# Altium schematic sheet V1_1001_REV2.SchDoc
size C
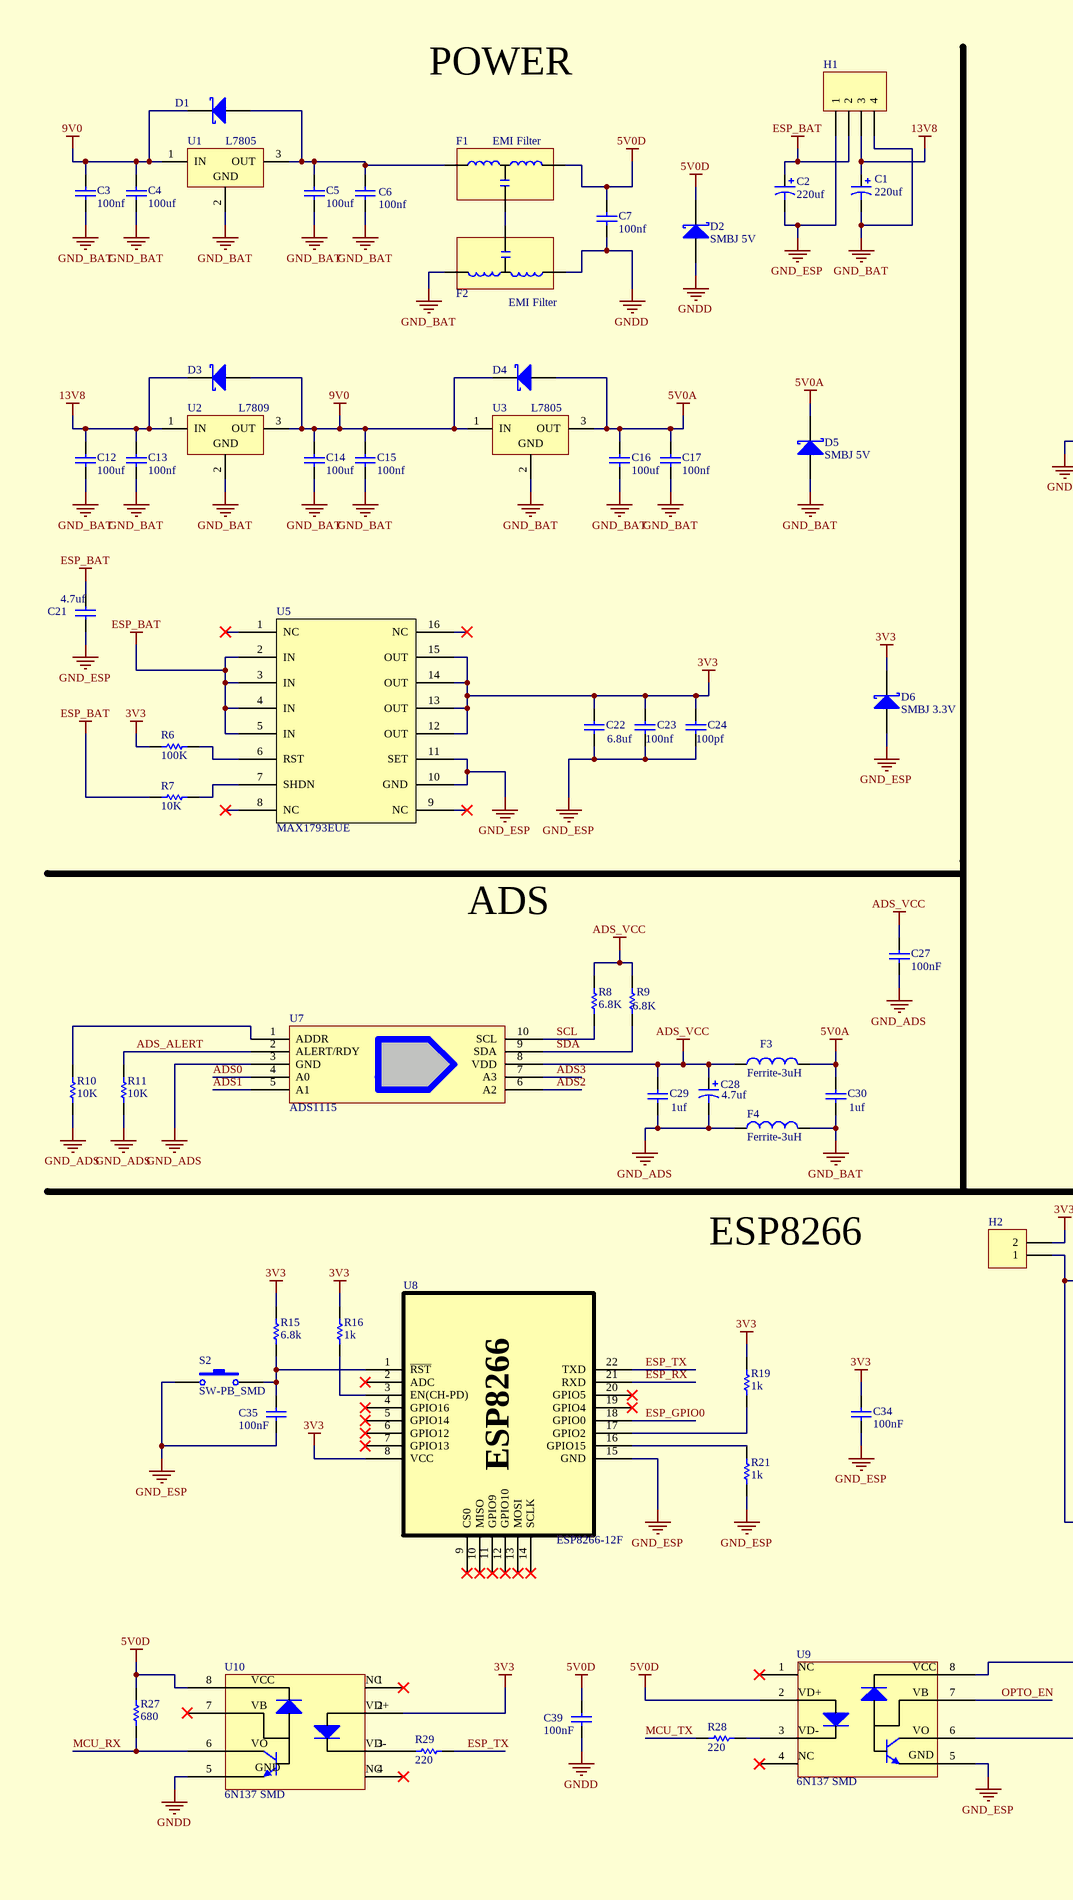
[diagram p0: V1_1001_REV2.SchDoc, left]
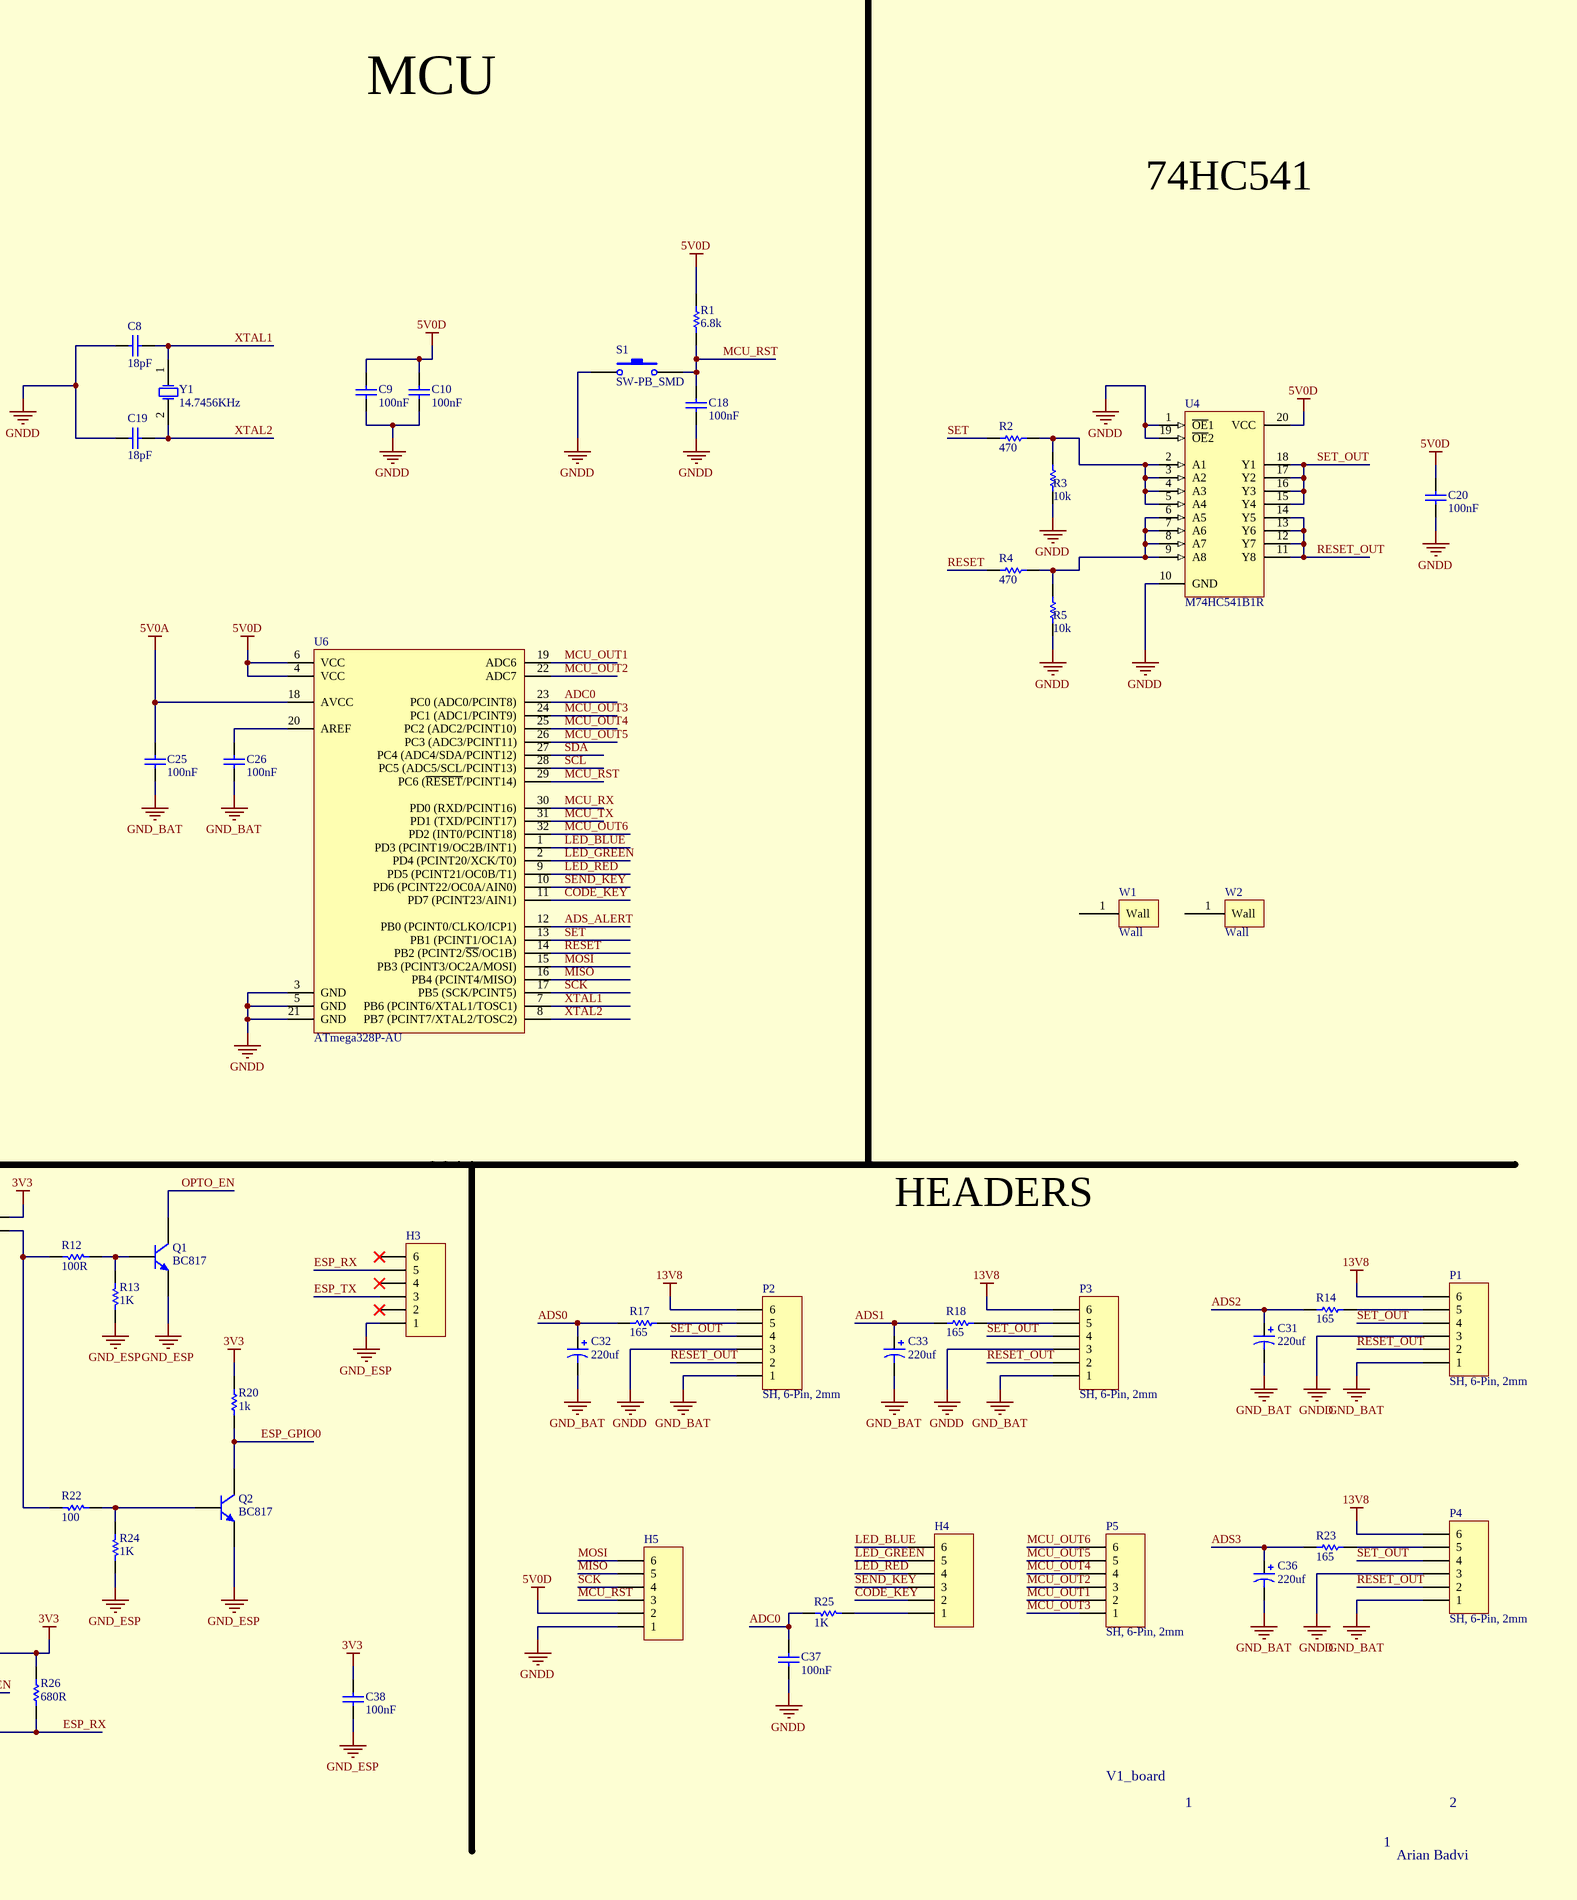
[diagram p1: V1_1001_REV2.SchDoc, right]

## Parts
C1  220uf  [C_CYL_SMD2]
C2  220uf  [C_CYL_SMD2]
C3  100nf  [1206]
C4  100uf  [1206]
C5  100uf  [1206]
C6  100nf  [1206]
C7  100nf  [1206]
C8  18pF  [1206]
C9  100nF  [1206]
C10  100nF  [1206]
C12  100uf  [1206]
C13  100nf  [1206]
C14  100uf  [1206]
C15  100nf  [1206]
C16  100uf  [1206]
C17  100nf  [1206]
C18  100nF  [1206]
C19  18pF  [1206]
C20  100nF  [1206]
C21  4.7uf  [1206]
C22  6.8uf  [1206]
C23  100nf  [1206]
C24  100pf  [1206]
C25  100nF  [1206]
C26  100nF  [1206]
C27  100nF  [1206]
C28  4.7uf  [CAP_SMD_A]
C29  1uf  [1206]
C30  1uf  [1206]
C31  220uf  [CAP_SMD_D]
C32  220uf  [CAP_SMD_D]
C33  220uf  [CAP_SMD_D]
C34  100nF  [1206]
C35  100nF  [1206]
C36  220uf  [CAP_SMD_D]
C37  100nF  [1206]
C38  100nF  [1206]
C39  100nF  [1206]
D1  D Schottky  [ZINER]  (value not drawn)
D2  SMBJ 5V  [TVS]
D3  D Schottky  [ZINER]  (value not drawn)
D4  D Schottky  [ZINER]  (value not drawn)
D5  SMBJ 5V  [TVS]
D6  SMBJ 3.3V  [TVS]
F1  EMI Filter  [HDR1X3]
F2  EMI Filter  [HDR1X3]
F3  Ferrite-3uH  [1206]
F4  Ferrite-3uH  [1206]
H1  White Connector 4pin  [XH_4_me]  (value not drawn)
H2  Pin Header, 1.27  [H1.27]  (value not drawn)
H3  White SMD Connector 6pin  [White SMD Connector 6pin B]  (value not drawn)
H4  White SMD Connector 6pin  [White SMD Connector 6pin B]  (value not drawn)
H5  White SMD Connector 6pin  [White SMD Connector 6pin B]  (value not drawn)
P1  SH, 6-Pin, 2mm  [PH_6_ME]
P2  SH, 6-Pin, 2mm  [PH_6_ME]
P3  SH, 6-Pin, 2mm  [PH_6_ME]
P4  SH, 6-Pin, 2mm  [PH_6_ME]
P5  SH, 6-Pin, 2mm  [PH_6_ME]
Q1  BC817  [sot23]
Q2  BC817  [sot23]
R1  6.8k  [1206]
R2  470  [1206]
R3  10k  [1206]
R4  470  [1206]
R5  10k  [1206]
R6  100K  [1206]
R7  10K  [1206]
R8  6.8K  [1206]
R9  6.8K  [1206]
R10  10K  [1206]
R11  10K  [1206]
R12  100R  [1206]
R13  1K  [1206]
R14  165  [1206]
R15  6.8k  [1206]
R16  1k  [1206]
R17  165  [1206]
R18  165  [1206]
R19  1k  [1206]
R20  1k  [1206]
R21  1k  [1206]
R22  100  [1206]
R23  165  [1206]
R24  1K  [1206]
R25  1K  [1206]
R26  680R  [1206]
R27  680  [1206]
R28  220  [1206]
R29  220  [1206]
S1  SW-PB_SMD  [PB4x3.2]
S2  SW-PB_SMD  [PB4x3.2]
U1  L7805  [DPAK]
U2  L7809  [DPAK]
U3  L7805  [DPAK]
U4  M74HC541B1R  [TSSOP20]
U5  MAX1793EUE  [TSSOP16]
U6  ATmega328P-AU  [32A_L]
U7  ADS1115  [TSSOP10_N]
U8  ESP8266-12F  [esp8266 esp-12-e]
U9  6N137 SMD  [SMD8]
U10  6N137 SMD  [SMD8]
W1  Wall  [Wall]
W2  Wall  [Wall]
Y1  14.7456KHz  [XTAL_SMD]

## Nets
3V3: C22.2 C23.2 C24.2 C34.2 C38.2 D6.1(K) H2.2 R6.2 R15.1 R16.2 R19.2 R20.1 R26.2 U5.12(OUT) U5.13(OUT) U5.14(OUT) U5.15(OUT) U8.8(VCC) U9.8 U10.2
5V0A: C16.2 C17.2 C25.2 C30.2 D4.1(A) D5.1(K) F3.2 U3.3(OUT) U6.18(AVCC)
5V0D: C7.2 C9.2 C10.2 C20.1 C39.2 D2.1(K) F1.3 H5.2 R1.1 R27.1 U4.20(VCC) U6.4(VCC) U6.6(VCC) U9.2 U10.8
9V0: C3.2 C4.2 C14.2 C15.2 D1.2(K) D3.1(A) D4.2(K) U1.1(IN) U2.3(OUT) U3.1(IN)
13V8: C1.1 C12.2 C13.2 D3.2(K) H1.3 P1.6 P2.6 P3.6 P4.6 U2.1(IN)
ADS_VCC: C27.2 C28.1 C29.2 F3.1 R8.1 R9.1 U7.8(VDD)
ESP_BAT: C2.1 C21.2 H1.2 R7.2 U5.2(IN) U5.3(IN) U5.4(IN) U5.5(IN)
GND_ADS: C27.1 C28.2 C29.1 F4.1 R10.1 R11.1 U7.3(GND)
GND_BAT: C1.2 C3.1 C4.1 C5.1 C6.1 C12.1 C13.1 C14.1 C15.1 C16.1 C17.1 C25.1 C26.1 C30.1 C31.2 C32.2 C33.2 C36.2 D5.2(A) F2.3 F4.2 H1.4 P1.1 P2.1 P3.1 P4.1 U1.2(GND) U2.2(GND) U3.2(GND)
GND_ESP: C2.2 C21.1 C22.1 C23.1 C24.1 C34.1 C35.1 C38.1 D6.2(A) H1.1 H3.1 Q1.1(E) Q2.1(E) R13.1 R21.2 R24.1 S2.1 U5.10(GND) U5.11(SET) U8.15(GND) U9.5(GND)
GNDD: C7.1 C8.1 C9.1 C10.1 C18.1 C19.1 C20.2 C37.1 C39.1 D2.2(A) F2.1 H5.1 P1.3 P2.3 P3.3 P4.3 R3.1 R5.1 S1.1 U4.1(~{OE}1) U4.10(GND) U4.19(~{OE}2) U6.3(GND) U6.5(GND) U6.21(GND) U10.5(GND)
ADC0: C37.2 R25.1 U6.23(PC0_(ADC0/PCINT8))
ADS0: C32.1 R17.2 U7.4(A0)
ADS1: C33.1 R18.2 U7.5(A1)
ADS2: C31.1 R14.2 U7.6(A2)
ADS3: C36.1 R23.2 U7.7(A3)
ADS_ALERT: R11.2 U6.12(PB0_(PCINT0/CLKO/ICP1)) U7.2(ALERT/RDY)
CODE_KEY: H4.2 U6.11(PD7_(PCINT23/AIN1))
ESP_GPIO0: Q2.3(C) R20.2 U8.18(GPIO0)
ESP_RX: H3.5 R26.1 U8.21(RXD) U9.6
ESP_TX: H3.3 R29.2 U8.22(TXD)
LED_BLUE: H4.6 U6.1(PD3_(PCINT19/OC2B/INT1))
LED_GREEN: H4.5 U6.2(PD4_(PCINT20/XCK/T0))
LED_RED: H4.4 U6.9(PD5_(PCINT21/OC0B/T1))
MCU_OUT1: P5.2 U6.19(ADC6)
MCU_OUT2: P5.3 U6.22(ADC7)
MCU_OUT3: P5.1 U6.24(PC1_(ADC1/PCINT9))
MCU_OUT4: P5.4 U6.25(PC2_(ADC2/PCINT10))
MCU_OUT5: P5.5 U6.26(PC3_(ADC3/PCINT11))
MCU_OUT6: P5.6 U6.32(PD2_(INT0/PCINT18))
MCU_RST: C18.2 H5.3 R1.2 S1.2 U6.29(PC6_(~{RESET}/PCINT14))
MCU_RX: R27.2 U6.30(PD0_(RXD/PCINT16)) U10.6
MCU_TX: R28.1 U6.31(PD1_(TXD/PCINT17))
MISO: H5.5 U6.16(PB4_(PCINT4/MISO))
MOSI: H5.6 U6.15(PB3_(PCINT3/OC2A/MOSI))
OPTO_EN: Q1.3(C) U9.7
RESET: R4.2 U6.14(PB2_(PCINT2/~{SS}/OC1B))
RESET_OUT: P1.2 P2.2 P3.2 P4.2 U4.11(Y8) U4.12(Y7) U4.13(Y6) U4.14(Y5)
SCK: H5.4 U6.17(PB5_(SCK/PCINT5))
SCL: R8.2 U6.28(PC5_(ADC5/SCL/PCINT13)) U7.10(SCL)
SDA: R9.2 U6.27(PC4_(ADC4/SDA/PCINT12)) U7.9(SDA)
SEND_KEY: H4.3 U6.10(PD6_(PCINT22/OC0A/AIN0))
SET: R2.2 U6.13(PB1_(PCINT1/OC1A))
SET_OUT: P1.4 P2.4 P3.4 P4.4 U4.15(Y4) U4.16(Y3) U4.17(Y2) U4.18(Y1)
XTAL1: C8.2 U6.7(PB6_(PCINT6/XTAL1/TOSC1)) Y1.1(OSC1)
XTAL2: C19.2 U6.8(PB7_(PCINT7/XTAL2/TOSC2)) Y1.2(OSC2)
NetC5_2: C5.2 C6.2 D1.1(A) F1.1 U1.3(OUT)
NetC26_2: C26.2 U6.20(AREF)
NetC35_2: C35.2 R15.2 S2.2 U8.1(~{RST})
NetF1_2: F1.2 F2.2
NetH2_1: H2.1 R12.1 R22.1
NetH4_1: H4.1 R25.2
NetP1_5: P1.5 R14.1
NetP2_5: P2.5 R17.1
NetP3_5: P3.5 R18.1
NetP4_5: P4.5 R23.1
NetQ1_2: Q1.2(B) R12.2 R13.2
NetQ2_2: Q2.2(B) R22.2 R24.2
NetR2_1: R2.1 R3.2 U4.2(A1) U4.3(A2) U4.4(A3) U4.5(A4)
NetR4_1: R4.1 R5.2 U4.6(A5) U4.7(A6) U4.8(A7) U4.9(A8)
NetR6_1: R6.1 U5.6(RST)
NetR7_1: R7.1 U5.7(SHDN)
NetR10_2: R10.2 U7.1(ADDR)
NetR16_1: R16.1 U8.3(EN(CH-PD))
NetR19_1: R19.1 U8.17(GPIO2)
NetR21_1: R21.1 U8.16(GPIO15)
NetR28_2: R28.2 U9.3
NetR29_1: R29.1 U10.3

Not connected (* = marked no-connect by the designer): H3 2* 4* 6*; U5 1(NC)* 8(NC)* 9(NC)* 16(NC)*; U8 2(ADC)* 4(GPIO16)* 5(GPIO14)* 6(GPIO12)* 7(GPIO13)* 9(CS0)* 10(MISO)* 11(GPIO9)* 12(GPIO10)* 13(MOSI)* 14(SCLK)* 19(GPIO4)* 20(GPIO5)*; U9 1* 4*; U10 1* 4* 7*; W1 1(Wall); W2 1(Wall)

## Notes on the sheet
- POWER
- MCU
- 74HC541
- ADS
- ESP8266
- HEADERS
- V1_board
- 1
- Arian Badvi
- 2
- (in symbol 6N137) VCC; NC; VB; VD+; VO; VD-

## Library data of the parts
C1 C2 = Cap Pol: pol cap, Ele; Published: 8-Jun-2000; LatestRevisionDate: 17-Jul-2002; LatestRevisionNote: Re-released for DXP Platform.; PackageReference: POLAR0.8; Publisher: Altium Limited; PackageDescription: Polarized Capacitor; 2 Leads; Value: 220uf
C3-C7 C12-C17 C21-C24 C29 C30 C39 = Cap: Capacitor, 1206; Published: 8-Jun-2000; LatestRevisionDate: 17-Jul-2002; LatestRevisionNote: Re-released for DXP Platform.; PackageReference: RAD-0.3; Publisher: Altium Limited
  C3 C6 C7 C13 C15 C17: Value: 100nf
  C4 C5 C12 C14 C16: Value: 100uf
  C21: PackageDescription: Radial Cap, Thru-Hole; 2 Leads; 0.3 in Pin Spacing; Value: 4.7uf
  C22: PackageDescription: Radial Cap, Thru-Hole; 2 Leads; 0.3 in Pin Spacing; Value: 6.8uf
  C23: PackageDescription: Radial Cap, Thru-Hole; 2 Leads; 0.3 in Pin Spacing; Value: 100nf
  C24: PackageDescription: Radial Cap, Thru-Hole; 2 Leads; 0.3 in Pin Spacing; Value: 100pf
  C29 C30: PackageDescription: Radial Cap, Thru-Hole; 2 Leads; 0.3 in Pin Spacing; Value: 1uf
  C39: Value: 100nF
C8-C10 C18 C19 C25-C27 C34 C35 C37 C38 = Cap: Capacitor; Published: 8-Jun-2000; LatestRevisionDate: 17-Jul-2002; LatestRevisionNote: Re-released for DXP Platform.; PackageReference: RAD-0.3; Publisher: Altium Limited
  C8 C19: Value: 18pF
  C9 C10 C18 C25-C27 C34 C35 C37 C38: Value: 100nF
C20 = Cap: Capacitor, 1206, 100nf; Published: 8-Jun-2000; LatestRevisionDate: 17-Jul-2002; LatestRevisionNote: Re-released for DXP Platform.; PackageReference: RAD-0.3; Publisher: Altium Limited; Value: 100nF
C28 = Cap Pol: Tantalium Capacitor; Published: 8-Jun-2000; LatestRevisionDate: 17-Jul-2002; LatestRevisionNote: Re-released for DXP Platform.; PackageReference: POLAR0.8; Publisher: Altium Limited; PackageDescription: Polarized Capacitor; 2 Leads; Value: 4.7uf
C31-C33 C36 = Cap Pol: pol cap, tan; Published: 8-Jun-2000; LatestRevisionDate: 17-Jul-2002; LatestRevisionNote: Re-released for DXP Platform.; PackageReference: POLAR0.8; Publisher: Altium Limited; PackageDescription: Polarized Capacitor; 2 Leads; Value: 220uf
D1 D3 D4 = D Schottky: Schottky Diode, 1N4148; Published: 8-Jun-2000; LatestRevisionDate: 17-Jul-2002; LatestRevisionNote: Re-released for DXP Platform.; PackageReference: SMB; Publisher: Altium Limited; Code_JEDEC: DO-214-AA
D2 D5 D6 = Diode 18TQ045: Schottky Rectifier; Note: Terminal 2 is the TAB and is electrically connected to the cathode; Published: 8-Jun-2000; LatestRevisionDate: 17-Jul-2002; LatestRevisionNote: Re-released for DXP Platform.; DatasheetVersion: Dec-1997; PackageVersion: Feb-1998; PackageReference: TO-220AC; Publisher: Altium Limited; ComponentLink1Description: Manufacturer Link; ComponentLink1URL: http://www.irf.com/; ComponentLink2Description: Datasheet; ComponentLink2URL: http://www.irf.com/product-info/datasheets/data/18tq.pdf
F3 F4 = Inductor: Code_IEC: 1005; Published: 8-Jun-2000; LatestRevisionDate: 29-May-2009; LatestRevisionNote: IPC-7351 Footprint Added.; PackageReference: 0402-A; Publisher: Altium Limited; PackageDescription: Chip Inductor; Code_JEITA: 0402
H1 = Header 4: LatestRevisionDate: 17-Jul-2002; LatestRevisionNote: Re-released for DXP Platform.; Publisher: Altium Limited
H2 = Header 2: Header, 2-Pin, 1.27mm; LatestRevisionDate: 17-Jul-2002; LatestRevisionNote: Re-released for DXP Platform.; Publisher: Altium Limited
H3-H5 P1-P5 = Header 6: LatestRevisionDate: 17-Jul-2002; LatestRevisionNote: Re-released for DXP Platform.; Publisher: Altium Limited
Q1 Q2 = 2N2222: General Purpose Transistor NPN Silicon; Published: 29-Sep-2000; LatestRevisionDate: 17-Jul-2002; LatestRevisionNote: Re-released for DXP Platform.; DatasheetVersion: 1991; PackageVersion: 1997; PackageReference: 22-03; Publisher: Altium Limited; PackageDescription: Can; 3 Leads; Pin Circle Dia. 2.54 mm; Lead Dia. 0.48 mm (max); ComponentLink1Description: Manufacturer Link; ComponentLink1URL: http://www.onsemi.com/site/products/landing?taxonomyID=194
R1 R15 R27 = Res1: Resistor, 6.8k; Published: 8-Jun-2000; LatestRevisionDate: 17-Jul-2002; LatestRevisionNote: Re-released for DXP Platform.; PackageReference: AXIAL-0.3; Publisher: Altium Limited
  R1 R15: Value: 6.8k
  R27: Value: 680
R2-R5 = Res1: Resistor, 1206, 4.7k; Published: 8-Jun-2000; LatestRevisionDate: 17-Jul-2002; LatestRevisionNote: Re-released for DXP Platform.; PackageReference: AXIAL-0.3; Publisher: Altium Limited
  R2 R4: Value: 470
  R3 R5: Value: 10k
R6-R13 R22 R24-R26 R28 R29 = Resistor: General Resistor; Published: 8-Jun-2000; LatestRevisionDate: 17-Jul-2002; LatestRevisionNote: Re-released for DXP Platform.; PackageReference: AXIAL-0.3; Publisher: Altium Limited; PackageDescription: Axial Device, Thru-Hole; 2 Leads; 0.3 in Pin Spacing
  R6: Value: 100K
  R7 R10 R11: Value: 10K
  R8 R9: Value: 6.8K
  R12: Value: 100R
  R13 R24 R25: Value: 1K
  R22: Value: 100
  R26: Value: 680R
  R28 R29: Value: 220
R14 R17 R18 R23 = Res1: Resistor, 1206; Published: 8-Jun-2000; LatestRevisionDate: 17-Jul-2002; LatestRevisionNote: Re-released for DXP Platform.; PackageReference: AXIAL-0.3; Publisher: Altium Limited; Value: 165
R16 R19-R21 = Res1: Resistor; Published: 8-Jun-2000; LatestRevisionDate: 17-Jul-2002; LatestRevisionNote: Re-released for DXP Platform.; PackageReference: AXIAL-0.3; Publisher: Altium Limited; Value: 1k
S1 S2 = SW-PB: Switch; Published: 24-Mar-1999; LatestRevisionDate: 17-Jul-2002; LatestRevisionNote: Re-released for DXP Platform.; PackageReference: SPST-2; Publisher: Altium Limited
U1-U3 = L7805CD2T: Positive Voltage Regulator; Published: 24-Aug-2001; LatestRevisionDate: 17-Jul-2002; LatestRevisionNote: Re-released for DXP Platform.; DatasheetVersion: Dec-1998; PackageReference: TO-263; Publisher: Altium Limited; PackageDescription: D2-PAK/TO-263-AB; 3 Leads (1 Cropped); Body 15.9 (inc. leads) x 10.4 mm (LxW max); ComponentLink1Description: Manufacturer Link; ComponentLink1URL: http://www.st.com/
U4 = M74HC541B1R: Octal Bus Buffer with 3 State Outputs (Non Inverted); Published: 8-Jun-2000; LatestRevisionDate: 06-Jun-2005; LatestRevisionNote: Stylized 3D Model Added.; DatasheetVersion: Oct-1993; PackageVersion: Jun-1998; PackageReference: DIP20; Publisher: Altium Limited; PackageDescription: DIP; 20 Leads; Row Spacing 7.62 mm; Pitch 2.54 mm; Code_JEDEC: MS-015-AE; ComponentLink1Description: Manufacturer Link; ComponentLink1URL: http://www.st.com/
U5 = MAX1793
U6 = ATmega328P-AU: 8-bit AVR Microcontroller, 32KB Flash, 1KB EEPROM, 2KB SRAM, 32-pin TQFP, Industrial Grade (-40°C to 85°C); Published: 1-Apr-2010; DatasheetVersion: revA, Jan-2010; PackageVersion: revB, Oct-2001; PackageReference: 32A; Publisher: Altium Limited; PackageDescription: 32-Lead, 7x7x1.0 mm Body, 0.8mm Lead Pitch, Thin Profile Plastic Quad Flat Package (TQFP); Supplier 1: Digi-Key; Supplier Part Number 1: ATMEGA328P-AU-ND; Supplier 2: Farnell; Supplier Part Number 2: 1715486; Supplier 3: Mouser; Supplier Part Number 3: 556-ATMEGA328P-AU; Code_JEDEC: MS-026-ABA; ComponentLink1Description: Manufacturer Link; ComponentLink1URL: http://www.atmel.com/products/avr/default.asp?; ComponentLink2Description: ATmega48A/48PA/88A/88PA/168A/168PA/328/328P Datasheet; ComponentLink2URL: http://www.atmel.com/dyn/resources/prod_documents/8271.pdf; ComponentLink3Description: ATmega48A/48PA/88A/88PA/168A/168PA/328/328P Summary; ComponentLink3URL: http://www.atmel.com/dyn/resources/prod_documents/8271S.pdf; ComponentLink4Description: Atmel.com Home; ComponentLink4URL: http://www.atmel.com
U8 = ESP8266
U9 U10 = 6N137
Y1 = XTAL: Crystal Oscillator, 14.7456KHz; Published: 8-Jun-2000; LatestRevisionDate: 17-Jul-2002; LatestRevisionNote: Re-released for DXP Platform.; PackageReference: R38; Publisher: Altium Limited